# Altium schematic sheet 平衡车36V双声LED5_20629.SchDoc
size A3
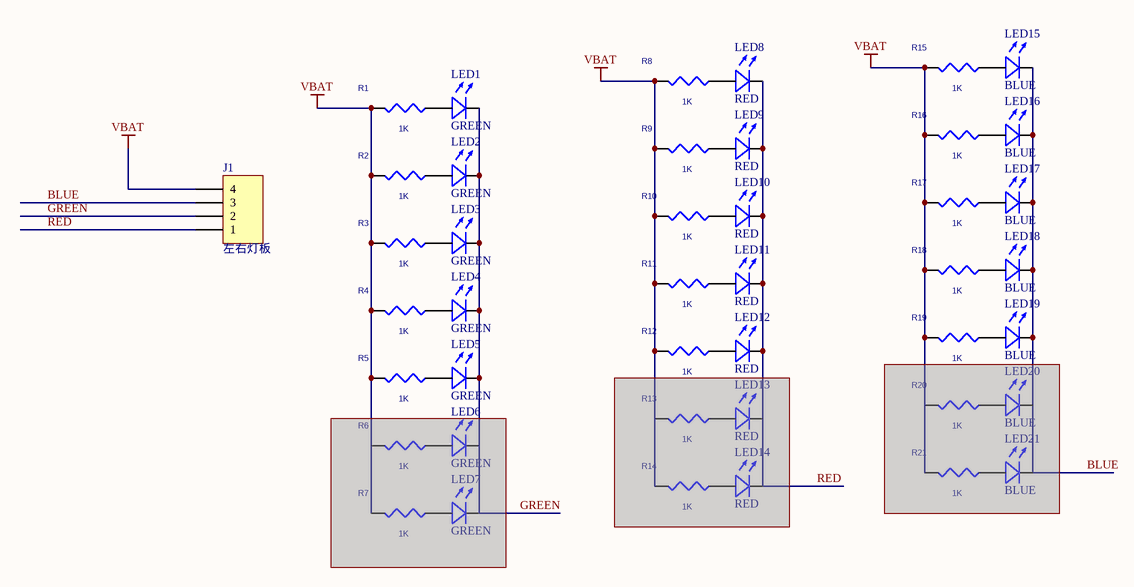
[diagram p0: 平衡车36V双声LED5_20629.SchDoc]

## Parts
J1  左右灯板  [4PIN-2.0]
LED1  GREEN  [2835LED]
LED2  GREEN  [2835LED]
LED3  GREEN  [2835LED]
LED4  GREEN  [2835LED]
LED5  GREEN  [2835LED]
LED6  GREEN  [2835LED]  (masked out: inside a compile mask, not in the netlist)
LED7  GREEN  [2835LED]  (masked out: inside a compile mask, not in the netlist)
LED8  RED  [2835LED]
LED9  RED  [2835LED]
LED10  RED  [2835LED]
LED11  RED  [2835LED]
LED12  RED  [2835LED]
LED13  RED  [2835LED]  (masked out: inside a compile mask, not in the netlist)
LED14  RED  [2835LED]  (masked out: inside a compile mask, not in the netlist)
LED15  BLUE  [2835LED]
LED16  BLUE  [2835LED]
LED17  BLUE  [2835LED]
LED18  BLUE  [2835LED]
LED19  BLUE  [2835LED]
LED20  BLUE  [2835LED]  (masked out: inside a compile mask, not in the netlist)
LED21  BLUE  [2835LED]  (masked out: inside a compile mask, not in the netlist)
R1  1K  [LC-1206_R]
R2  1K  [LC-1206_R]
R3  1K  [LC-1206_R]
R4  1K  [LC-1206_R]
R5  1K  [LC-1206_R]
R6  1K  [LC-1206_R]  (masked out: inside a compile mask, not in the netlist)
R7  1K  [LC-1206_R]  (masked out: inside a compile mask, not in the netlist)
R8  1K  [LC-1206_R]
R9  1K  [LC-1206_R]
R10  1K  [LC-1206_R]
R11  1K  [LC-1206_R]
R12  1K  [LC-1206_R]
R13  1K  [LC-1206_R]  (masked out: inside a compile mask, not in the netlist)
R14  1K  [LC-1206_R]  (masked out: inside a compile mask, not in the netlist)
R15  1K  [LC-1206_R]
R16  1K  [LC-1206_R]
R17  1K  [LC-1206_R]
R18  1K  [LC-1206_R]
R19  1K  [LC-1206_R]
R20  1K  [LC-1206_R]  (masked out: inside a compile mask, not in the netlist)
R21  1K  [LC-1206_R]  (masked out: inside a compile mask, not in the netlist)

## Nets
VBAT: J1.4 R1.2 R2.2 R3.2 R4.2 R5.2 R8.2 R9.2 R10.2 R11.2 R12.2 R15.2 R16.2 R17.2 R18.2 R19.2
BLUE: J1.3 LED15.k LED16.k LED17.k LED18.k LED19.k
GREEN: J1.2 LED1.k LED2.k LED3.k LED4.k LED5.k
RED: J1.1 LED8.k LED9.k LED10.k LED11.k LED12.k
NetLED1_a: LED1.a R1.1
NetLED2_a: LED2.a R2.1
NetLED3_a: LED3.a R3.1
NetLED4_a: LED4.a R4.1
NetLED5_a: LED5.a R5.1
NetLED8_a: LED8.a R8.1
NetLED9_a: LED9.a R9.1
NetLED10_a: LED10.a R10.1
NetLED11_a: LED11.a R11.1
NetLED12_a: LED12.a R12.1
NetLED15_a: LED15.a R15.1
NetLED16_a: LED16.a R16.1
NetLED17_a: LED17.a R17.1
NetLED18_a: LED18.a R18.1
NetLED19_a: LED19.a R19.1

## Library data of the parts
J1 = Header 4: Header, 4-Pin; LatestRevisionDate: 17-Jul-2002; LatestRevisionNote: Re-released for DXP Platform.; Publisher: Altium Limited
LED1-LED21 = LED
R1-R21 = R_Dup1